# EAGLE design untitled (EAGLE 9.6.2)
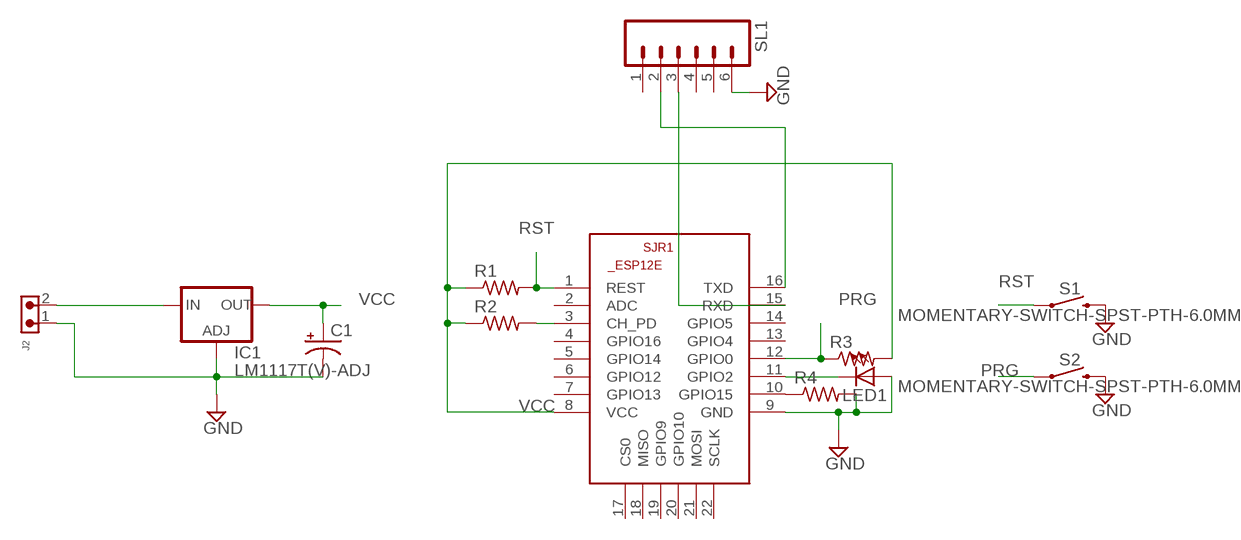
[diagram p0: schematic, sheet 1]

## Parts
C1  CAPACITOR-PE5-10.5  [E5-10,5]
IC1  LM1117T(V)-ADJ  [TO220V]
J2  691305530002  [691305530002]
LED1  LED5MM  [LED5MM]
R1  R-US_0207/10  [0207/10]
R2  R-US_0207/10  [0207/10]
R3  R-US_0207/10  [0207/10]
R4  R-US_0207/10  [0207/10]
S1  MOMENTARY-SWITCH-SPST-PTH-6.0MM  [TACTILE_SWITCH_PTH_6.0MM]
S2  MOMENTARY-SWITCH-SPST-PTH-6.0MM  [TACTILE_SWITCH_PTH_6.0MM]
SJR1  ESP8266-12EESP12E  [ESP8266-ESP12E]
SL1  M06  [06P]

## Nets
GND: C1.- IC1.1(ADJ) J2.1 LED1.A R4.2 S1.3 S2.3 SJR1.9(GND) SL1.6
N$1: IC1.3(IN) J2.2
N$2: R2.2 SJR1.3(CH_PD)
N$3: SJR1.16(TXD) SL1.2
N$4: SJR1.15(RXD) SL1.3
N$5: LED1.K(C) SJR1.11(GPIO2)
N$6: R4.1 SJR1.10(GPIO15)
PRG: R3.1 S2.1 SJR1.12(GPIO0)
RST: R1.2 S1.1 SJR1.1(REST)
VCC: C1.+ IC1.2(OUT) R1.1 R2.1 R3.2 SJR1.8(VCC)
Unconnected: SJR1.2(ADC) SJR1.4(GPIO16) SJR1.5(GPIO14) SJR1.6(GPIO12) SJR1.7(GPIO13) SJR1.13(GPIO4) SJR1.14(GPIO5) SJR1.17(CS0) SJR1.18(MISO) SJR1.19(GPIO9) SJR1.20(GPIO10) SJR1.21(MOSI) SJR1.22(SCLK) SL1.1 SL1.4 SL1.5

## Library data of the parts
C1 = BeagleBone_Blue_R3:CAPACITOR-P: POLARIZED CAPACITOR, American symbol
IC1 = lm1117_10:LM1117?-ADJ: 800mA Low-Dropout Linear Regulator Source: http://www.ti.com/lit/ds/symlink/lm1117-n.pdf; MF: Texas Instruments; MPN: LM1777T-ADJ; OC_FARNELL: 9485805; OC_NEWARK: 13B5345
J2 = Wurth_Connectors_WR-TBL Pluggable Connector:691305530002: WR-TBL Serie 3055 - 5,08 mm - PCB Header Vertical Entry with Plastic Latches KIND PROPERTIES Pitch 5.08 mm MATERIAL PROPERTIES Insulator Material PA66 Insulator Flammability Rating UL94 V-0 Insulator Color Green Terminal Material Copper Alloy Terminal Plating Tin-plated surface GENERAL INFORMATION Operating Temperature -40 up to +105 °C ELECTRICAL PROPERTIES IR UL 16 A Working Voltage [UL] 300 V (AC) Withstanding Voltage [UL] 2500 V (AC) Contact Resistance [UL] 20 mΩ CERTIFICATION UL Approval E315414 <https://www.we-online.com/catalog/media/o135349v209%20Family_WR-TBL3_6913055300xx.jpg> Details see: https://www.we-online.com/catalog/en/TBL_5_08_3055_6913055300XX/ Updated by Ella Wu 2019-12-30 2019(C) Wurth Elektronik; DATASHEET-URL: https://www.we-online.com/catalog/datasheet/691305530002.pdf; IR-UL: 16A; MOUNT: THT; PART-NUMBER: 691305530002; PINS: 2; PITCH: 5.08mm; TYPE: Vertical; WORKING-VOLTAGE-UL: 300V (AC)
LED1 = adafruit:LED: LED OSRAM: - CHIPLED LG R971, LG N971, LY N971, LG Q971, LY Q971, LO R971, LY R971 LH N974, LH R974 LS Q976, LO Q976, LY Q976 LO Q996 - Hyper CHIPLED LW Q18S LB Q993, LB Q99A, LB R99A - SideLED LS A670, LO A670, LY A670, LG A670, LP A670 LB A673, LV A673, LT A673, LW A673 LH A674 LY A675 LS A676, LA A676, LO A676, LY A676, LW A676 LS A679, LY A679, LG A679 - Hyper Micro SIDELED® LS Y876, LA Y876, LO Y876, LY Y876 LT Y87S - SmartLED LW L88C, LW L88S LB L89C, LB L89S, LG L890 LS L89K, LO L89K, LY L89K LS L896, LA L896, LO L896, LY L896 - TOPLED LS T670, LO T670, LY T670, LG T670, LP T670 LSG T670, LSP T670, LSY T670, LOP T670, LYG T670 LG T671, LOG T671, LSG T671 LB T673, LV T673, LT T673, LW T673 LH T674 LS T676, LA T676, LO T676, LY T676, LB T676, LH T676, LSB T676, LW T676 LB T67C, LV T67C, LT T67C, LS T67K, LO T67K, LY T67K, LW E67C LS E67B, LA E67B, LO E67B, LY E67B, LB E67C, LV E67C, LT E67C LW T67C LS T679, LY T679, LG T679 LS T770, LO T770, LY T770, LG T770, LP T770 LB T773, LV T773, LT T773, LW T773 LH T774 LS E675, LA E675, LY E675, LS T675 LS T776, LA T776, LO T776, LY T776, LB T776 LHGB T686 LT T68C, LB T68C - Hyper Mini TOPLED® LB M676 - Mini TOPLED Santana® LG M470 LS M47K, LO M47K, LY M47K Source: http://www.osram.convergy.de/
R1-R4 = adafruit:R-US_: RESISTOR, American symbol
S1 S2 = SparkFun-Switches:MOMENTARY-SWITCH-SPST: Momentary Switch (Pushbutton) - SPST Normally-open (NO) SPST momentary switches (buttons, pushbuttons). Variants PTH-12MM - 12mm square, through-hole Momentary Pushbutton Switch - 12mm Square <https://www.sparkfun.com/products/9190> (COM-09190) PTH-6.0MM, PTH-6.0MM-KIT - 6.0mm square, through-hole Mini Pushbutton Switch <https://www.sparkfun.com/products/97> (COM-00097) KIT package intended for soldering kit's - only one side of pads' copper is exposed. PTH-RIGHT-ANGLE-KIT - Right-angle, through-hole Right Angle Tactile Button <https://www.sparkfun.com/products/10791> - Used on SparkFun BigTime Watch Kit <https://www.sparkfun.com/products/11734> SMD-12MM - 12mm square, surface-mount Tactile Button - SMD (12mm) <https://www.sparkfun.com/products/12993> (COM-12993) Used on SparkFun PicoBoard <https://www.sparkfun.com/products/11888> SMD-4.5MM - 4.5mm Square Trackball Switch Used on SparkFun Blackberry Trackballer Breakout <https://www.sparkfun.com/products/13169> SMD-4.6MMX2.8MM - 4.60mm x 2.80mm, surface mount Used on SparkFun SAMD21 Mini Breakout <https://www.sparkfun.com/products/13664> SMD-5.2MM, SMD-5.2-REDUNDANT - 5.2mm square, surface-mount Mini Pushbutton Switch - SMD <https://www.sparkfun.com/products/8720> (COM-08720) Used on Arduino Pro Mini <https://www.sparkfun.com/products/11114> REDUNDANT package connects both switch circuits together SMD-6.0X3.5MM - 6.0 x 3.5mm, surface mount Momentary Reset Switch SMD <https://www.sparkfun.com/products/8229> (COM-08229) SMD-6.2MM-TALL - 6.2mm square, surface mount Tactile Button - SMD (6mm) <https://www.sparkfun.com/products/12992> Used on SparkFun Digital Sandbox <https://www.sparkfun.com/products/12651> SMD-RIGHT-ANGLE - Right-angle, surface mount Used on SparkFun Block for Intel® Edison - Arduino <https://www.sparkfun.com/products/13036>; PROD_ID: SWCH-08441; SF_SKU: COM-00097
SJR1 = esp12e:ESP8266-12E: ESP8266-12E Library for Eagle CAD The author not responsible for any damages or errors!. Created by Suhail jr.lt;/author>
SL1 = con-amp-quick:M06: AMP QUICK CONNECTOR; OC_FARNELL: unknown; OC_NEWARK: unknown

## Board
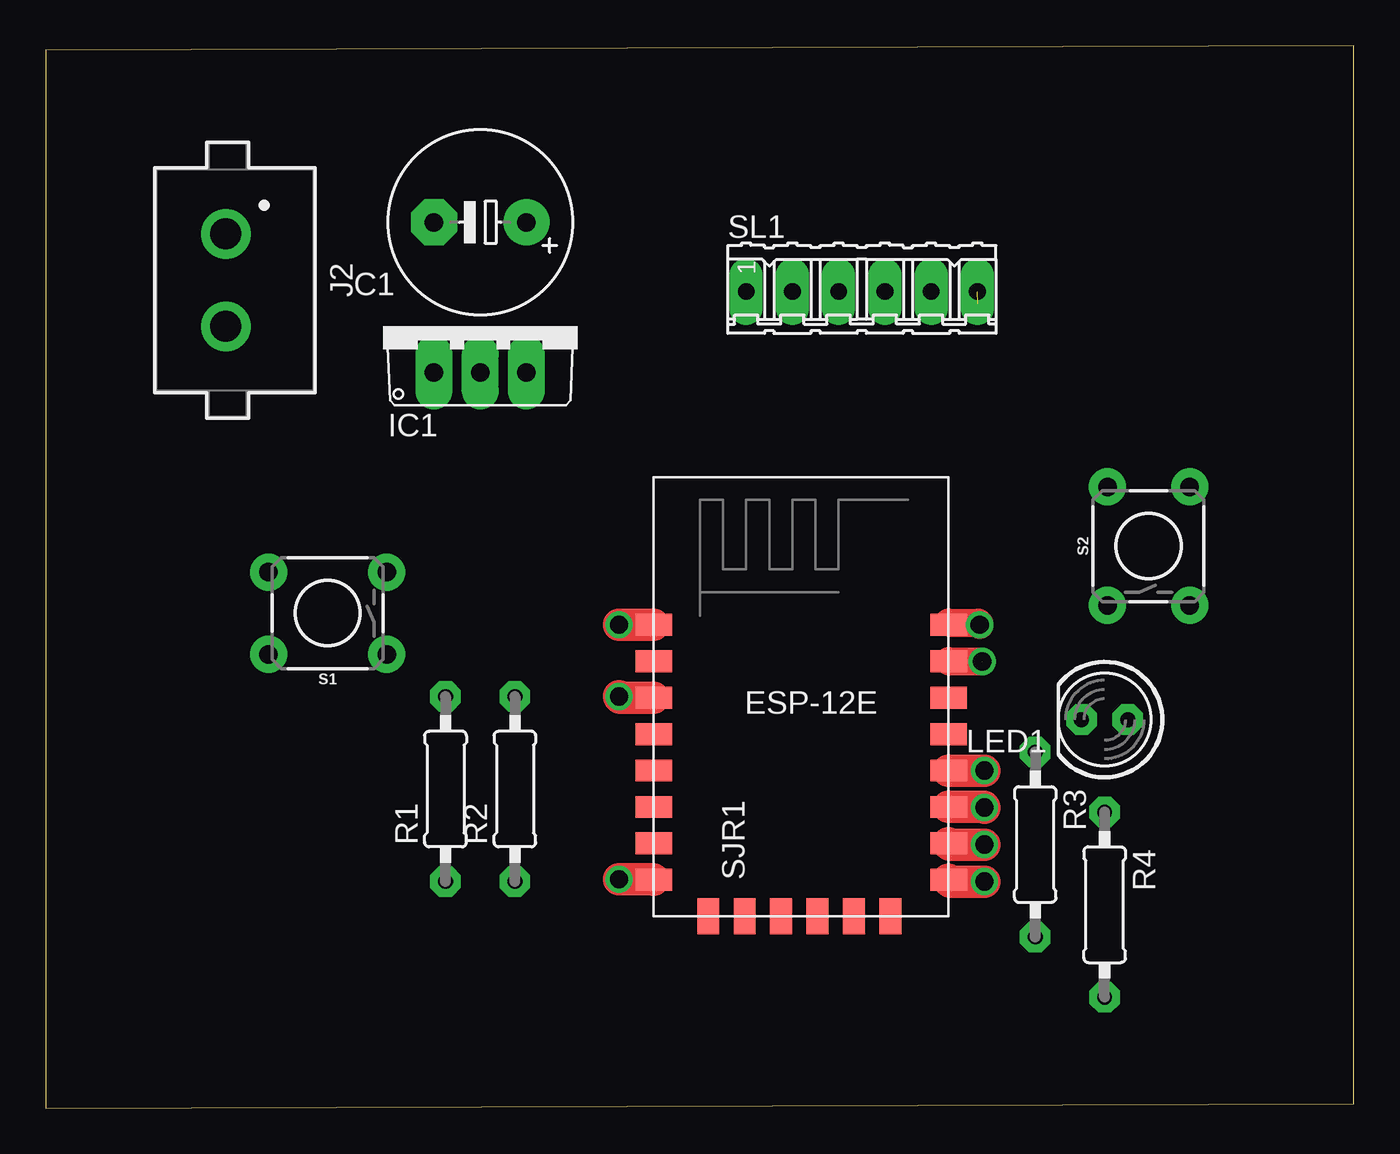
[diagram p1: board, top side]
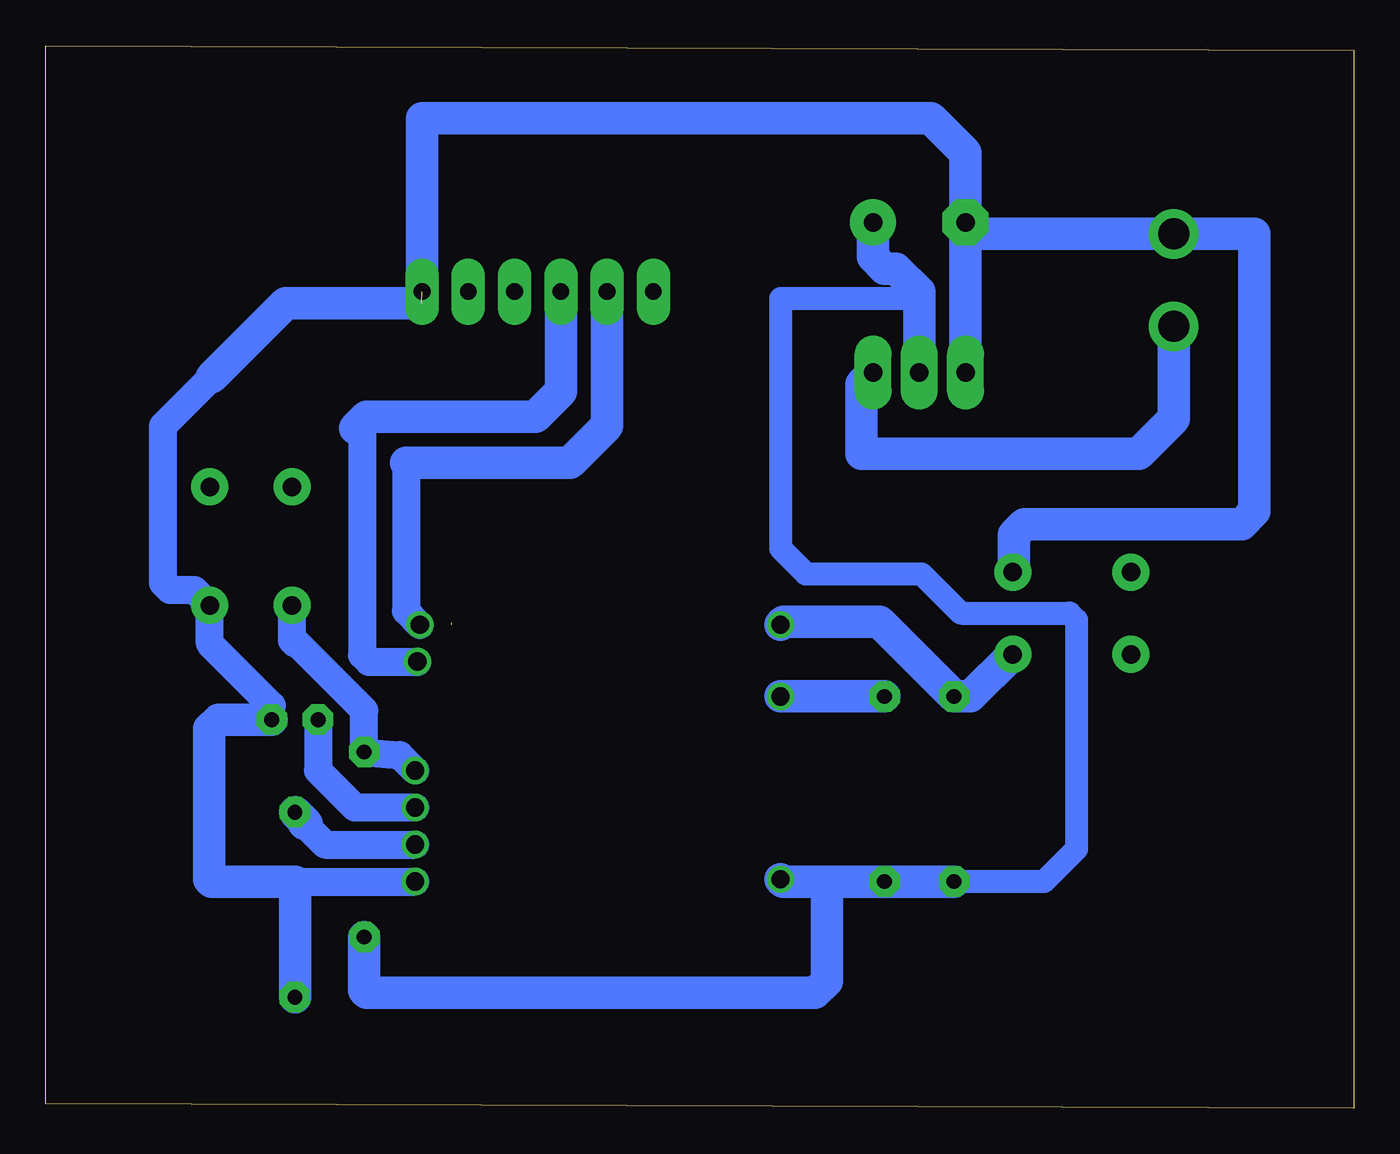
[diagram p2: board, bottom side, seen from below]

Size 71.86 x 58.34 mm. Coordinates in mm from the lower left corner, seen from the top.
Outline: 0,0 71.86,0.25 71.86,58.34 0,58.09 0,0
Copper layers (1*16): Top 0.035mm / dielectric 1.5mm / Bottom 0.035mm
Design rules "default *": minimum track width 6mil, minimum drill 0.35mm, track to track 20mil, track to pad 20mil, pad to pad 20mil, via to via 20mil, smd to smd 6mil, copper to edge 40mil, drill to drill 6mil, minimum pad ring 10mil, minimum via ring 8mil, stop-mask expansion 4mil, vias tented up to drill 0mil, thermal gap 10mil

### Footprints (pad centres in the part's own frame; a part is rotated, then mirrored left to right if it is on the bottom)
E5-10,5 = drill 1.016 pad 2.54: + -2.54,0 | drill 1.016 pad 2.54 octagon: - 2.54,0
TO220V = drill 1.016 long: 1 -2.54,-2.54; 2 0,-2.54; 3 2.54,-2.54
691305530002 = drill 1.7: 1 -2.54,0; 2 2.54,0
LED5MM = drill 0.813 pad 1.676 octagon: A -1.27,0; K 1.27,0
0207/10 = drill 0.813 pad 1.676 octagon: 1 -5.08,0; 2 5.08,0
TACTILE_SWITCH_PTH_6.0MM = drill 1.016 pad 1.88: 1 -3.251,2.261; 2 3.251,2.261; 3 -3.251,-2.261; 4 3.251,-2.261
ESP8266-ESP12E = smd 2 x 1.2: 1 -7.62,5.84; 2 -7.62,3.84; 3 -7.62,1.84; 4 -7.62,-0.16; 5 -7.62,-2.16; 6 -7.62,-4.16; 7 -7.62,-6.16; 8 -7.62,-8.16; 9 8.58,-8.16; 10 8.58,-6.16; 11 8.58,-4.16; 12 8.58,-2.16; 13 8.58,-0.16; 14 8.58,1.84; 15 8.58,3.84; 16 8.58,5.84 | smd 1.2 x 2: 17 -4.62,-10.16; 18 -2.62,-10.16; 19 -0.62,-10.16; 20 1.38,-10.16; 21 3.38,-10.16; 22 5.38,-10.16
06P = drill 0.914 long: 1 -6.35,0; 2 -3.81,0; 3 -1.27,0; 4 1.27,0; 5 3.81,0; 6 6.35,0

### Placement (x,y rotation side)
C1  23.88,48.64 180 top
IC1  23.88,42.93 0 top
J2  9.91,45.47 270 top
LED1  58.17,21.34 180 top
R1  21.97,17.53 90 top
R2  25.78,17.53 90 top
R3  54.36,14.48 270 top
R4  58.17,11.18 270 top
S1  15.49,27.18 180 top
S2  60.58,30.86 90 top
SJR1  41.02,20.7 0 top
SL1  44.83,44.83 0 top

### Tracks (layer width: path | path; a pad name or v marks a point on that pad's centre or on a via)
GND  (via drill 1)  (2 unrouted)
  Top 1.778: v51.56,12.45 49.7,12.45 SJR1.9
  Bottom 1.524: 58.17,12.45 v51.56,12.45 | LED1.A 59.44,22.1 62.84,25.5 S2.3 63.68,28.45 65.02,28.45 65.41,28.83 65.41,37.46 62.74,40.13
  Bottom 1.778: C1.- 20.7,48.01 J2.1 5.46,48.01 5.46,32.77 6.16,32.07 18.1,32.07 18.67,31.5 18.67,29.51 S1.3 | C1.- 21.34,52.45 23.24,54.36 51.18,54.36 51.18,44.2 | IC1.1 C1.- | R4.2 58.17,12.45 62.74,12.45 62.87,12.57 62.87,20.83 62.36,21.34 LED1.A | 62.74,40.13 58.67,44.2 51.21,44.2
N$1
  Bottom 1.778: J2.2 9.91,37.85 11.81,35.94 27.05,35.94 27.05,39.75 IC1.3
N$2  (via drill 1)
  Top 1.778: SJR1.3 31.56,22.54 v31.5,22.61
  Bottom 1.778: v31.5,22.61 R2.2
N$3  (via drill 1 pad 0.7)  (1 unrouted)
  Top 1.524: v51.31,26.54 51.31,26.59 51.23,26.66 49.6,26.66
  Bottom 1.524: 52.07,35.43 52.07,27.3 v51.31,26.54
  Bottom 1.778: SL1.2 41.02,37.46 43.05,35.43 52.07,35.43
N$4  (via drill 1)  (1 unrouted)
  Top 1.524: v51.44,24.52 49.62,24.52 SJR1.15
  Bottom 1.524: 54.23,37.97 54.48,37.72 54.48,24.89 54.1,24.51 v51.44,24.51
  Bottom 1.778: SL1.3 43.56,39.37 44.96,37.97 54.23,37.97 54.86,37.34
N$5  (via drill 1)
  Top 1.778: SJR1.11 51.53,16.54 v51.56,16.51
  Bottom 1.524: v51.56,16.51 54.86,16.51 56.9,18.54 LED1.K
N$6  (via drill 1)
  Top 1.778: v51.56,14.48 49.66,14.48 SJR1.10
  Bottom 1.524: 57.66,15.62 56.52,14.48 v51.56,14.48
  Bottom 1.778: R4.1 57.53,15.62 57.66,15.62
PRG  (via drill 1)
  Top 1.778: v51.56,18.54 SJR1.12
  Bottom 1.524: v51.56,18.54 52.41,19.39 R3.1 54.36,21.84 58.04,25.53 58.17,25.53 58.32,25.68 S2.1
RST  (via drill 1)
  Top 1.778: v31.5,26.54 SJR1.1
  Bottom 1.778: v31.5,26.54 31.34,26.7 26.06,26.7 R1.2 21.06,22.61 S1.1
VCC  (via drill 1)
  Top 1.778: v31.5,12.57 33.37,12.57 SJR1.8
  Bottom 1.27: 23.88,44.83 24.26,44.45 31.5,44.45 31.5,30.73 30.1,29.34 23.75,29.34 21.59,27.18 15.62,27.18 15.24,26.8 15.24,14.22 17.02,12.45 R1.1
  Bottom 1.778: IC1.2 23.88,44.83 25.15,46.1 25.78,46.1 26.42,46.74 C1.+ | R1.1 R2.1 28.96,12.45 | 28.96,12.45 31.37,12.45 v31.5,12.57 | 28.96,12.45 28.96,6.98 29.59,6.35 54.23,6.35 54.36,6.48 R3.2